# EAGLE design Adafruit LIS3DH (EAGLE 9.6.1)
COMPANY: ADAFRUIT INDUSTRIES; DRAWN: KTOWN; REV: A
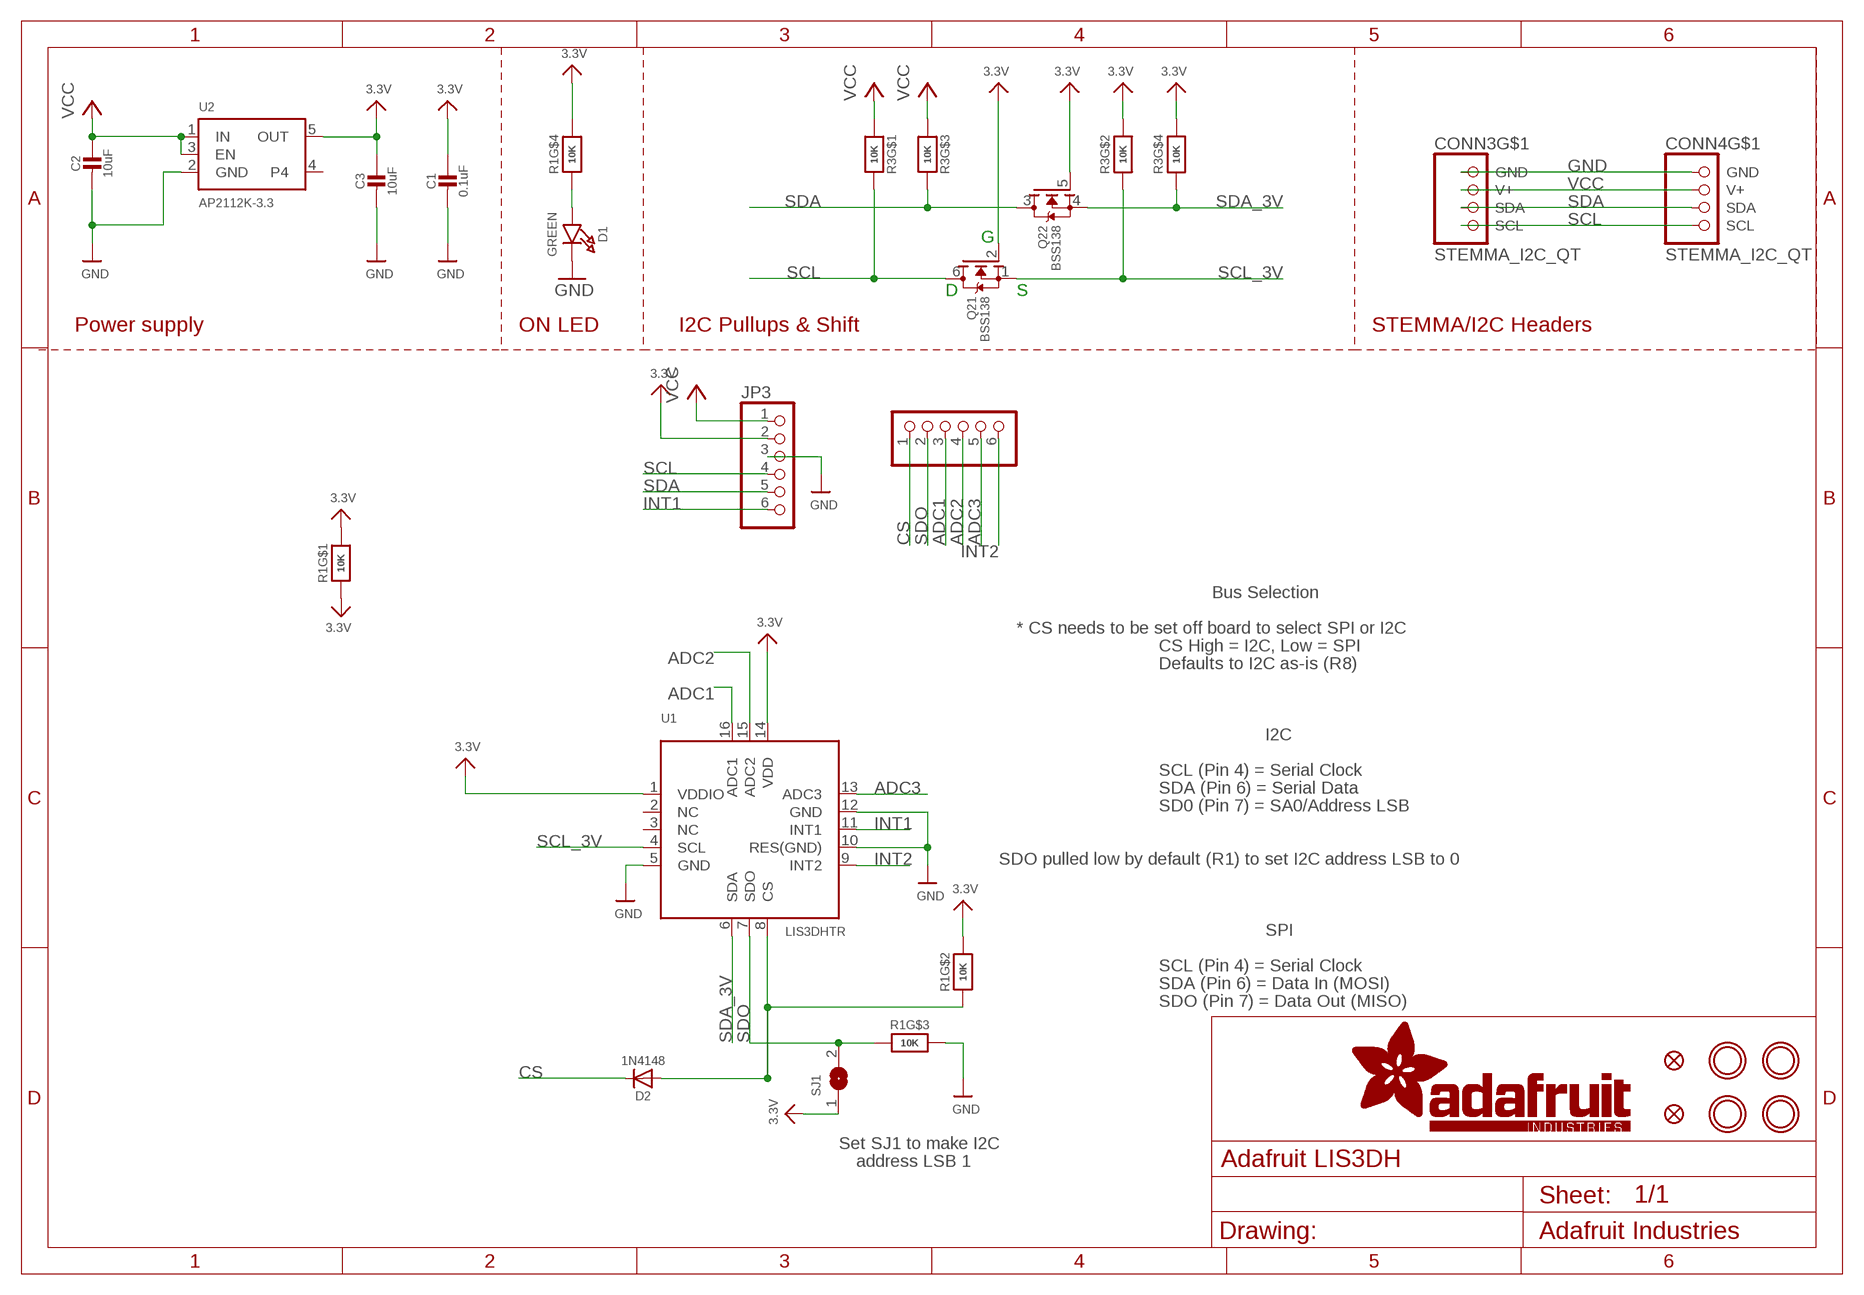
[diagram p0: schematic, sheet 1]

## Parts
C1  0.1uF  CAP_CERAMIC0603_NO  [0603-NO]
C2  10uF  CAP_CERAMIC0805-NOOUTLINE  [0805-NO]
C3  10uF  CAP_CERAMIC0805-NOOUTLINE  [0805-NO]
CONN3  STEMMA_I2C_QT  [JST_SH4]
CONN4  STEMMA_I2C_QT  [JST_SH4]
D1  GREEN  LED0603_NOOUTLINE  [CHIPLED_0603_NOOUTLINE]
D2  1N4148  DIODESOD-323  [SOD-323]
FID3  FIDUCIAL_1MM  [FIDUCIAL_1MM]
FID4  FIDUCIAL_1MM  [FIDUCIAL_1MM]
JP2  HEADER-1X670MIL  [1X06_ROUND_70]
JP3  HEADER-1X670MIL  [1X06_ROUND_70]
Q2  BSS138  MOSFET-N_DUAL  [SOT363]
R1  10K  RESISTOR_4PACK  [RESPACK_4X0603]
R3  10K  RESISTOR_4PACK  [RESPACK_4X0603]
SJ1  SOLDERJUMPER  [SOLDERJUMPER_ARROW_NOPASTE]
U1  LIS3DHTR  ACCEL_LIS3DHTR  [LGA16_3X3MM]
U2  AP2112K-3.3  VREG_SOT23-5  [SOT23-5]
U$1  MOUNTINGHOLE2.5  [MOUNTINGHOLE_2.5_PLATED]
U$17  MOUNTINGHOLE2.5  [MOUNTINGHOLE_2.5_PLATED]
U$19  MOUNTINGHOLE2.5  [MOUNTINGHOLE_2.5_PLATED]
U$21  MOUNTINGHOLE2.5  [MOUNTINGHOLE_2.5_PLATED]

## Nets
3.3V [lowpower]: C1.1 C3.1 JP3.2 Q2.2(1:G) Q2.5(2:G) R1.1 R1.5 R1.7 R1.8 R3.2 R3.4 SJ1.1 U1.1(VDDIO) U1.14(VDD) U2.5(OUT)
ADC1: JP2.3 U1.16(ADC1)
ADC2: JP2.4 U1.15(ADC2)
ADC3: JP2.5 U1.13(ADC3)
CS: D2.C JP2.1
GND [highpower]: C1.2 C2.2 C3.2 CONN3.1(GND) CONN4.1(GND) D1.C JP3.3 R1.6 U1.5(GND) U1.10(RES(GND)) U1.12(GND) U2.2(GND)
INT1: JP3.6 U1.11(INT1)
INT2: JP2.6 U1.9(INT2)
N$1: D1.A R1.4
N$2: D2.A R1.2 U1.8(CS)
SCL: CONN3.4(SCL) CONN4.4(SCL) JP3.4 Q2.6(1:D) R3.8
SCL_3V: Q2.1(1:S) R3.7 U1.4(SCL)
SDA: CONN3.3(SDA) CONN4.3(SDA) JP3.5 Q2.3(2:D) R3.6
SDA_3V: Q2.4(2:S) R3.5 U1.6(SDA)
SDO: JP2.2 R1.3 SJ1.2 U1.7(SDO)
VCC [highpower]: C2.1 CONN3.2(V+) CONN4.2(V+) JP3.1 R3.1 R3.3 U2.1(IN) U2.3(EN)
Unconnected: CONN3.MT1(MT) CONN3.MT2(MT) CONN4.MT1(MT) CONN4.MT2(MT) U1.2(NC) U1.3(NC) U2.4

## Notes on the sheet
- G
- D | S
- Power supply | ON LED | I2C Pullups & Shift | STEMMA/I2C Headers
- Bus Selection
- * CS needs to be set off board to select SPI or I2C
- CS High = I2C, Low = SPI
- Defaults to I2C as-is (R8)
- I2C
- SCL (Pin 4) = Serial Clock
- SDA (Pin 6) = Serial Data
- SD0 (Pin 7) = SA0/Address LSB
- SDO pulled low by default (R1) to set I2C address LSB to 0
- SPI
- SCL (Pin 4) = Serial Clock
- SDA (Pin 6) = Data In (MOSI)
- SDO (Pin 7) = Data Out (MISO)
- Set SJ1 to make I2C
- address LSB 1

## Library data of the parts
C1-C3 = microbuilder:CAP_CERAMIC: Ceramic Capacitors For new designs, use the packages preceded by an '_' character since they are more reliable: The following footprints should be used on most boards: _0402 - Standard footprint for regular board layouts _0603 - Standard footprint for regular board layouts _0805 - Standard footprint for regular board layouts _1206 - Standard footprint for regular board layouts For extremely tight-pitch boards where space is at a premium, the following 'micro-pitch' footprints can be used (smaller pads, no silkscreen outline, etc.): _0402MP - Micro-pitch footprint for very dense/compact boards _0603MP - Micro-pitch footprint for very dense/compact boards _0805MP - Micro-pitch footprint for very dense/compact boards _1206MP - Micro-pitch footprint for very dense/compact boards
CONN3 CONN4 = microbuilder:STEMMA_I2C
D1 = microbuilder:LED: LED 0603 - 0603 Surface Mount Package 2mA: Green LED - Low Power (3.9mcd, 2ma, 1.7Vf) - Digikey: 475-2709-2-ND Orange LED - Low Power (9.8mcd, 2ma, 1.8Vf) - Digikey: 475-1194-2-ND Red LED - Low Power (5mcd, 2ma, 1.8Vf) - Digikey: 475-1195-2-ND Yellow LED - Low Power (7mcd, 2ma, 1.8Vf) - Digikey: 475-1196-2-ND 5mA: Blue LED - Low Power (17mcd, 5ma, 2.9Vf) - Digikey: LNJ937W8CRACT-ND 0805 - 0805 Surface Mount Package 2mA: Red LED (8.8mcd, 2mA, 1.8Vf, Clear) - Low Power [Digikey: 475-2510-1-ND] Green LED (5mcd, 2mA, 1.8Vf, Clear) - Low Power [Digikey: 475-2730-1-ND] Yellow LED (11.3mcd, 2mA, 1.8Vf, Clear) - Low Power [Digikey: 475-2555-1-ND] 20mA: Red LED (104mcd, 20mA, Diffused) - LS R976 [Digikey: 475-1278-6-ND] Red LED (12mcd, 20mA, 2.0Vf, Clear) - APT2012EC [Digikey: 754-1128-1-ND] Green LED (15mcd, 20mA, 2.2Vf, Clear) - APT2012GC [Digikey: 754-1131-1-ND] Orange LED (160mcd, 20mA, 2.1Vf, Clear) - APT2012SECK [Digikey: 754-1130-1-ND] 1206 - 1206 Surface Mount Package Green LED (26mcd, 20mA, Diffused) - LG N971 [Digikey: 475-1407-6-ND] Red LED (15mcd, 20mA, Diffused) - LH N974 [Digikey: 475-1416-6-ND] Cree - Cree High-Power Surface Mount LEDs XPEBWT-L1-0000-00D50 - White 111lm 350mA 2.9Vf 6200K 110° XTEAWT-00-0000-00000LEE3 - White 114lm 350mA 2.85Vf 5000K 115° Everlight - Everlight 45-21 Series Surface Mount LEDs 45-21/QK2C-B2832AC2CB2/2T - Warm White 2000mcd 20mA 3.25Vf 3050K 120° 45-21/LK2C-B38452C4CB2/2T - Nuetral White 2000mcd 20mA 3.25Vf 4150K 120° 45-21/LK2C-B50634C6CB2/2T - Cold White 2200mcd 20mA 3.25Vf 5650K 120° PLCC2 Reverse Mount LS T77K-J1L2-1-0-2-R18-Z - Red 11.25mcd 2mA 1.8Vf 630nm 120° LO T77K-L1M2-24-Z - Orange 19.6mcd 2mA 1.8Vf 606nm 120° LY T77K-K2M1-26-Z - Yellow 15.7mcd 2mA 1.8Vf 587nm 120°
D2 = microbuilder:DIODE: Diode SMA Model Volts Amps Type Vf Ir Digikey # Notes SSA34-E3 40V 3A Schottky 480mV @ 3A 200uA @ 40V SSA34-E3/61TGITR-ND CDBA120-G 20V 1A Schottky 500mV @ 1A 500uA @ 20V 641-1014-6-ND REEL MBRA210 10V 2A Schottky 350mV @ 2A 700uA @ 10V MBRA210LT3 SOD-123 Model Volts Amps Type Vf Ir Order # Notes BAT54T1G 30V 200mA Schottky 800mV @ 200mA 2uA @ 25V BAT54T1GOSTR-ND B0530W 30V 500mA Schottky 430mV @ 500mA 130uA @ 30V B0530W-FDICT-ND REEL MBR120 20V 1A Schottky 340mV @ 1A MBR120VLSFT1GOSCT-ND SOD-323 Model Volts Amps Type Vf Ir Order # Notes PMEG2005EJ 20V 500mA Schottky 355mV @ 500mA 568-4110-1-ND ZLLS410 10V 570mA Schottky 380mV @ 570mA ZLLS410CT-ND 1N4148WS 75V 150mA Silicon/Simple 1V 1N4148WSFSCT-ND REEL SOD-523 Model Volts Amps Type Vf Ir Order # Notes BAT54XV2 30V 200mA Schottky 0.8V @ 100mA BAT54XV2CT-ND TB751S 30V 30mA Schottky RB751S-40TE61CT-ND SOT23-R/W (R = Solder Paste/Reflow Ovens, W = Hand-Soldering) Model Volts Amps Type Vf Ir Order # Notes BAT54FILM 40V 300mA Schottky 497-7162-1-ND POWERDI-5 Model Volts Amps Type Vf Ir Order # Notes PDS560 60V 5A Schottky 670mV @ 5A 150uA @ 60V PDS560DICT-ND
FID3 FID4 = microbuilder:FIDUCIAL: Fiducial Alignment Points Various fiducial points for machine vision alignment.; BOM: EXCLUDE
JP2 JP3 = microbuilder:HEADER-1X6: PIN HEADER
Q2 = microbuilder:MOSFET-N_DUAL: Dual N-Channel MOSFET SOT363 (2.0x1.25mm) 2N7002PS - 60V, 320mA [Digikey: 568-5984-1-ND]
R1 R3 = microbuilder:RESISTOR_4PACK: Resistor Packs (4 resistors) 4 x 0603 10K 1/16W - Digikey: YC164J-10KCT-ND
SJ1 = microbuilder:SOLDERJUMPER: SMD Solder JUMPER Solder the two pads together to create a connection, or remove the solder to break it. REFLOW - Use this footprint for solder paste and reflow ovens. WAVE - Use this footprint for hand-soldering (larger pads). CLOSED - Has a trace between the two pads to ensure it is closed by default. The trace needs to be cut to disable the jumper, and can be closed again by creating a solder bridge between the two pads.; BOM: EXCLUDE
U1 = microbuilder:ACCEL_LIS3DHTR: LIS3DHTR 3-Axis Accelerometer with I2C/SPI Interface VDD: 1.71-3.6V VDDIO: 1.71-VDD+0.1V Scale: +/-2g, 4g, 8g, 16g with 16--bit data output Temp:: -40°C - 85°C Mouser: 511-LIS3DHTR Digikey: 497-10613-1-ND
U2 = microbuilder:VREG_SOT23-5: SOT23-5 Fixed Voltage Regulators Part Current Out V Out V In V Dropout θJA (°C/W) TJ (°C) Digikey Part No. ADP121 150mA 3.3V 3.4-5.5V 0.09V @ 150mA -- -- ADP121-AUJZ33R7CT-ND ADP121 150mA 3.0V 3.1-5.5V 0.09V @ 150mA -- -- ADP121-AUJZ30R7CT-ND ADP122 300mA 3.3V 3.4-5.5V 0.085V @ 300mA -- -- ADP122AUJZ-3.3-R7CT-ND ADP1712 300mA 3.3V 3.5-5.5V 0.17V @ 300mA -- -- ADP1712AUJZ-3.3-R7TR-ND AP7311 (Low Cost) 150mA 3.3V 3.5-6V 0.15V @ 150mA -- -- AP7311-33WG-7DICT-ND LD39015M18R 150mA 1.8V 1.9V-5.5V 0.08V @ 100mA -- -- 497-6977-1-ND LP2985A-33DBVR 150mA 3.3V 3.3-16V 0.28V @ 150mA 206 150 296-18479-1-ND MCP1824T-3302E/OT 300mA 3.3V 3.5V-6V 0.2V @ 300mA -- -- MCP1824T-3302E/OTCT-ND MIC5205-2.5YM5 TR 150mA 2.5V 2.7-16V 0.165V @ 150mA -- -- 576-1257-2-ND MIC5205-3.0YM5 TR 150mA 3.0V 3.2V-16V 0.165V @ 150mA -- -- 576-1258-2-ND MIC5205-3.3YM5 TR 150mA 3.3V 3.5V-16V 0.165V @ 150mA -- -- 576-1259-2-ND TPS780330220 150mA 3.3V+2.2V 3.6-5.5V 250mV Max -- -- 296-23332-1-ND TDA3663/N1,135 100mA 3.3V 3.5-45V 0.18V @ 50mA -- -- 568-5343-1-ND Max operating temp can be calculated using θJA, TJ (max junction temperature), and power in watts. Set the "Maximum Ambient Temperature" until it reaches TJ ("Max Junction Temperature"), which is the absolute limit for safe use of the regulator: Heat Sink Temperature Calculator <http://www.daycounter.com/Calculators/Heat-Sink-Temperature-Calculator.phtml> For example, With 12V source into a 3.3V LP2985 and a 30mA load, we are dissipating (12V-3.3V) * 0.03A = 0.261W. With a θJA of 206 °C/W, a TJ of 150°C, and 261mW we can safely use the chip without a heat sink up to 75°C (=147.1°C Junction Temperature).
U$1 U$17 U$19 U$21 = microbuilder:MOUNTINGHOLE: Mounting Hole For #2 screws (0.086"/2.18mm width, 0.094"/2.4mm hole) use 2.5mm; BOM: EXCLUDE

## Net classes
1 highpower: width 0.406 mm, drill 0.483 mm
2 lowpower: width 0.305 mm, drill 0.483 mm

## Board
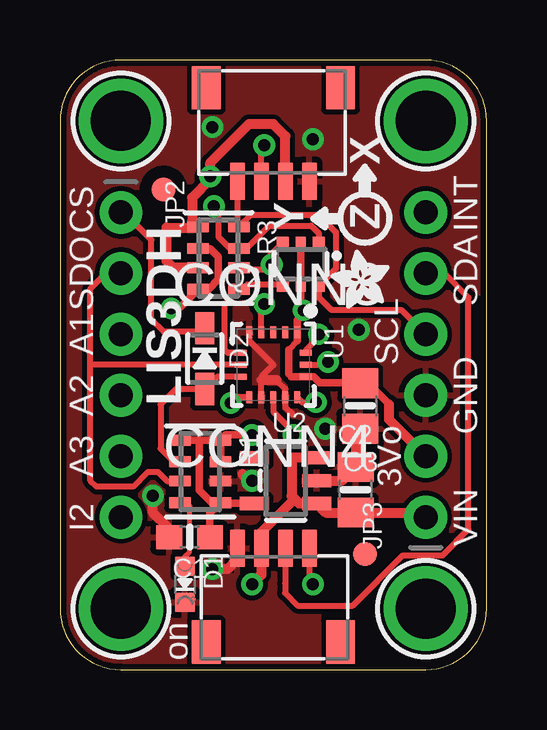
[diagram p1: board, top side]
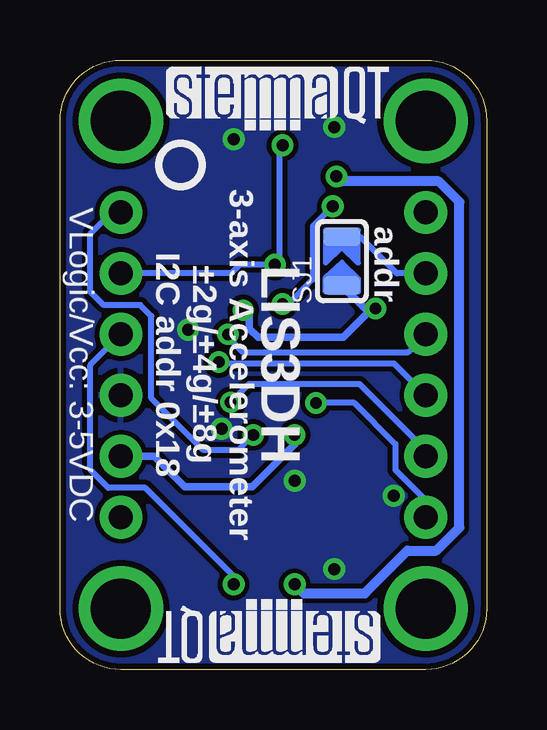
[diagram p2: board, bottom side, seen from below]

Size 17.78 x 25.4 mm. Coordinates in mm from the lower left corner, seen from the top.
Outline: 2.54,0 15.24,0 arc90 17.78,2.54 17.78,22.86 arc90 15.24,25.4 2.54,25.4 arc90 0,22.86 0,2.54 arc90 2.54,0
Copper layers (1*16): Top 0.035mm / dielectric 1.5mm / Bottom 0.035mm
Design rules "adafruit *": minimum track width 8mil, minimum drill 15.5mil, track to track 8mil, track to pad 8mil, pad to pad 8mil, via to via 8mil, smd to smd 8mil, copper to edge 10mil, drill to drill 8mil, minimum pad ring 10mil, minimum via ring 8mil, stop-mask expansion 2mil, vias tented up to drill 20mil, thermal gap 10mil

### Footprints (pad centres in the part's own frame; a part is rotated, then mirrored left to right if it is on the bottom)
0603-NO = smd 1.075 x 1: 1 -0.85,0; 2 0.85,0
0805-NO = smd 1.24 x 1.5: 1 -0.95,0; 2 0.95,0
JST_SH4 = smd 0.6 x 1.55: 1 -1.5,2.514; 2 -0.5,2.514; 3 0.5,2.514; 4 1.5,2.514 | smd 1.2 x 1.8: MT1 -2.8,-1.386; MT2 2.8,-1.386
CHIPLED_0603_NOOUTLINE = smd 0.8 x 0.8: A 0,-0.75; C 0,0.75
SOD-323 = smd 1.35 x 0.8: A 1.27,0; C -1.27,0
FIDUCIAL_1MM = smd 1 x 1: 1 0,0
1X06_ROUND_70 = drill 1 pad 1.778: 1 -6.35,0; 2 -3.81,0; 3 -1.27,0; 4 1.27,0; 5 3.81,0; 6 6.35,0
SOT363 = smd 0.5 x 0.5: 1 -0.75,-0.9; 3 0.75,-0.9; 4 0.75,0.9; 6 -0.75,0.9 | smd 0.4 x 0.5: 2 0,-0.9; 5 0,0.9
RESPACK_4X0603 = smd 0.45 x 0.9: 1 -1.3,-0.85; 2 -0.4,-0.85; 3 0.4,-0.85; 4 1.3,-0.85; 5 1.3,0.85; 6 0.4,0.85; 7 -0.4,0.85; 8 -1.3,0.85
SOLDERJUMPER_ARROW_NOPASTE = smd 0.762 x 1.524: 1 -1.016,0; 2 1.016,0
LGA16_3X3MM = smd 0.5 x 0.25: 1 -1.35,1; 2 -1.35,0.5; 3 -1.35,0; 4 -1.35,-0.5; 5 -1.35,-1; 9 1.35,-1; 10 1.35,-0.5; 11 1.35,0; 12 1.35,0.5; 13 1.35,1 | smd 0.25 x 0.5: 6 -0.5,-1.35; 7 0,-1.35; 8 0.5,-1.35; 14 0.5,1.35; 15 0,1.35; 16 -0.5,1.35
SOT23-5 = smd 0.55 x 1.2: 1 -0.95,-1.3; 2 0,-1.3; 3 0.95,-1.3; 4 0.95,1.3; 5 -0.95,1.3
MOUNTINGHOLE_2.5_PLATED = drill 2.5 pad 3.2: P$1 0,0

### Placement (x,y rotation side)
C1  5.4,5.52 180 top
C2  12.32,7.49 90 top
C3  12.51,10.99 270 top
CONN3  8.89,22.86 180 top
CONN4  8.89,2.54 0 top
D1  5.21,3.56 180 top
D2  6.03,12.95 270 top
FID3  12.7,4.83 90 top
FID4  4.32,20 90 top
JP2  2.54,12.7 270 top
JP3  15.24,12.7 90 top
Q2  10.03,16.89 180 top
R1  5.84,8.26 270 top
R3  6.6,17.14 270 top
SJ1  6.03,17.02 90 bottom
U1  8.89,12.7 270 top
U2  9.4,7.87 90 top
U$1  2.54,2.54 90 top
U$12  [ADAFRUIT_2.5MM]  13.72,15.05 90 top
U$17  2.54,22.86 90 top
U$19  15.24,2.54 90 top
U$21  15.24,22.86 90 top
U$25  [PCBFEAT-REV-040]  12.76,21.02 270 bottom
U$30  [STEMMAQT]  13.34,22.48 0 bottom
U$31  [STEMMAQT]  4.45,2.92 180 bottom

### Tracks (layer width: path | path; a pad name or v marks a point on that pad's centre or on a via)
3.3V  (via drill 0.48)
  Top 0.254: 9.53,13.34 9.89,13.7
  Top 0.305: R3.2 6.27,17.55 6.6,17.21 6.6,16.26 6.19,15.85 R3.4 4.8,14.89 v4.64,15.05 | 9.53,13.34 9.53,12.32 9.64,12.2 U1.14 10.58,12.2 10.83,11.95 12.5,11.95 | 9.89,13.7 U1.1 9.89,14.56 10.14,14.81 v10.14,14.97 10.03,15.08 Q2.5 Q2.2 | 12.5,11.95 C3.1 | 13.72,11.05 12.82,11.95 12.5,11.95 | C1.1 6.25,6.51 6.5,6.77 | 6.5,6.77 R1.5 6.72,6.92 U2.5 | R1.8 5.91,9.55 | 5.91,9.55 R1.1 | R1.8 R1.7 | R1.8 6.92,9.78 v8,9.78 | 5.91,9.55 5.8,9.45 5.8,7.47 6.5,6.77
  Top 0.406: JP3.2 13.72,10.41 13.72,11.05
  Bottom 0.305: v10.14,14.97 9.89,14.72 9.89,14.21 9.53,13.84 5.97,13.84 4.76,15.05 v4.64,15.05 5.08,15.05 SJ1.1 | v8,9.78 8,9.4 9.78,7.62 12.57,7.62 13.84,8.89 JP3.2
ADC1  (via drill 0.48)
  Top 0.254: v10.78,13.97 10.78,13.84 10.24,13.3 U1.16
  Bottom 0.254: v10.78,13.97 10.78,13.84 10.17,13.23 3.28,13.23 JP2.3
ADC2  (via drill 0.48)
  Top 0.254: U1.15 11.05,12.7 v11.16,12.81
  Bottom 0.254: JP2.4 3.86,12.75 11.1,12.75 v11.16,12.81
ADC3  (via drill 0.48)
  Top 0.254: U1.13 10.1,11.14 v10.67,11.14
  Bottom 0.254: JP2.5 2.54,9.14 5.3,11.9 9.91,11.9 v10.67,11.14
CS
  Top 0.254: D2.C 5.91,14.1 4.32,14.1 3.81,14.61 3.81,17.91 2.67,19.05 JP2.1
GND  (via drill 0.5)
  Top 0.203: U1.5 7.89,13.7
  Top 0.254: 7.89,13.7 8.89,12.7 8.39,12.2 8.39,12.06 U1.10 | 9.02,12.06 9.39,11.69 U1.12 9.39,10.93 9.69,10.63
  Top 0.406: U2.2 11.75,7.87 C2.2 12.32,10.33 | CONN4.1 7.34,5 7.34,4.55 6.99,4.19 v6.35,4.19 | 7.61,8.14 7.87,7.87 | 9.02,12.06 8.39,12.06 | C1.2 4.55,5.87 3.87,6.54 v3.87,7.24
  other vias: 10.54,22.1 8,7.87 6.35,22.61 11.05,10.03 12.45,14.16
  pour Top: 0,0 0,25.4 17.78,25.4 17.78,0
  pour Bottom: 0,0 0,25.4 17.78,25.4 17.78,0
INT1  (via drill 0.48)
  Top 0.254: U1.11 8.89,10.74 9.73,9.91 v9.73,9.78
  Bottom 0.254: v9.73,9.78 10.36,9.14 11.81,9.14 13.97,11.3 13.97,14.73 14.43,15.19 15.95,15.19 16.51,15.75 16.51,18.16 15.62,19.05 JP3.6
INT2  (via drill 0.48)
  Top 0.254: U1.9 7.35,11.35 v7.11,11.11
  Bottom 0.254: JP2.6 2.54,7.05 3.81,8.32 3.81,9.4 5.52,11.11 v7.11,11.11
N$1
  Top 0.203: D1.A 5.21,4.71 5.39,4.9 5.39,6.8
  Top 0.254: R1.4 5.24,6.96 5.39,6.8
N$2
  Top 0.254: U1.8 6.55,12.2 D2.A 4.83,11.68 4.19,11.05 4.19,9.21 4.74,8.65 R1.2
SCL  (via drill 0.5)
  Top 0.254: CONN3.4 7.39,18.51 R3.8 7.96,18.95 10.77,18.95 11.49,18.22 11.49,16.7 Q2.6 10.78,15.51 11.3,14.99 14.22,14.99 JP3.4 | CONN4.4 10.39,3.71 v10.54,3.56
  Bottom 0.254: JP3.4 16.51,12.7 16.51,8.32 15.76,7.57 14.22,7.57 10.54,3.88 v10.54,3.56
SCL_3V  (via drill 0.48, 0.5)
  Top 0.254: v6.41,19.3 6.6,19.11 6.6,18.03 7.09,17.55 R3.7 7.77,17.55 8.72,18.5 10.46,18.5 10.78,18.17 Q2.1 | v8.51,15.24 8.39,15.12 U1.4
  Bottom 0.254: v6.41,19.3 7.24,18.48 7.24,16.26 8.26,15.24 v8.51,15.24
SDA  (via drill 0.5)
  Top 0.254: R3.6 7.52,16.68 8.6,16.68 8.79,16.87 v8.83,16.87 8.78,16.92 8.78,17.28 Q2.3 | CONN4.3 9.39,3.58 9.38,3.58 9.38,3.2 9.91,2.67 12.19,2.67 14.29,4.76 15.94,4.76 17.02,5.84 17.02,15.49 16,16.51 JP3.5 | CONN3.3 8.39,21.73 v8.51,21.84
  Bottom 0.254: v8.51,21.84 8.64,21.72 8.64,17.06 v8.83,16.87 10.29,16.87 10.65,16.51 JP3.5
SDA_3V
  Top 0.254: Q2.4 9.22,16.05 7.82,16.05 7.61,15.85 R3.5 6.86,15.25 6.86,13.34 6.99,13.2 U1.6
SDO
  Top 0.254: 1.27,12.7 1.27,7.87 1.52,7.62 3.05,7.62 3.66,8.24 4.08,8.24 4.46,7.86 R1.3 | U1.7 1.27,12.7 | 1.27,12.7 1.27,15.88 1.91,16.51 JP2.2
  Bottom 0.254: JP2.2 3.75,16.51 5.27,18.03 SJ1.2
VCC  (via drill 0.5)
  Top 0.406: R3.3 4.72,16.75 4.45,17.02 4.45,18.41 5.72,18.41 R3.1 5.5,18.7 5.5,19.66 6.26,20.42 v6.26,20.55 6.26,21.12 7.87,22.73 8.89,22.73 9.39,22.23 CONN3.2 | U2.3 9.65,8.82 9.65,7.24 9.78,7.11 | 9.78,7.11 9.97,6.92 U2.1 11.08,6.54 C2.1 15.05,6.54 JP3.1 | 9.78,7.11 8.39,5.73 CONN4.2 8.39,3.94 v8,3.56
  Bottom 0.406: v6.26,20.55 6.06,20.34 2,20.34 1.14,19.48 1.14,5.92 2.1,4.95 3.3,4.95 5.08,3.17 7.62,3.17 v8,3.56

### Text on the board
tPlace: X | CS | Z | INT | Y | SDO | SDA | LIS3DH | A1 | SCL | A2 | GND | A3 | 3Vo | I2 | VIN | on
bPlace: addr | LIS3DH | 3-axis Accelerometer / ±2g/±4g/±8g / I2C addr 0x18 | VLogic/Vcc: 3-5VDC